# EAGLE schematic openservo-v28 (EAGLE 7.5.0)
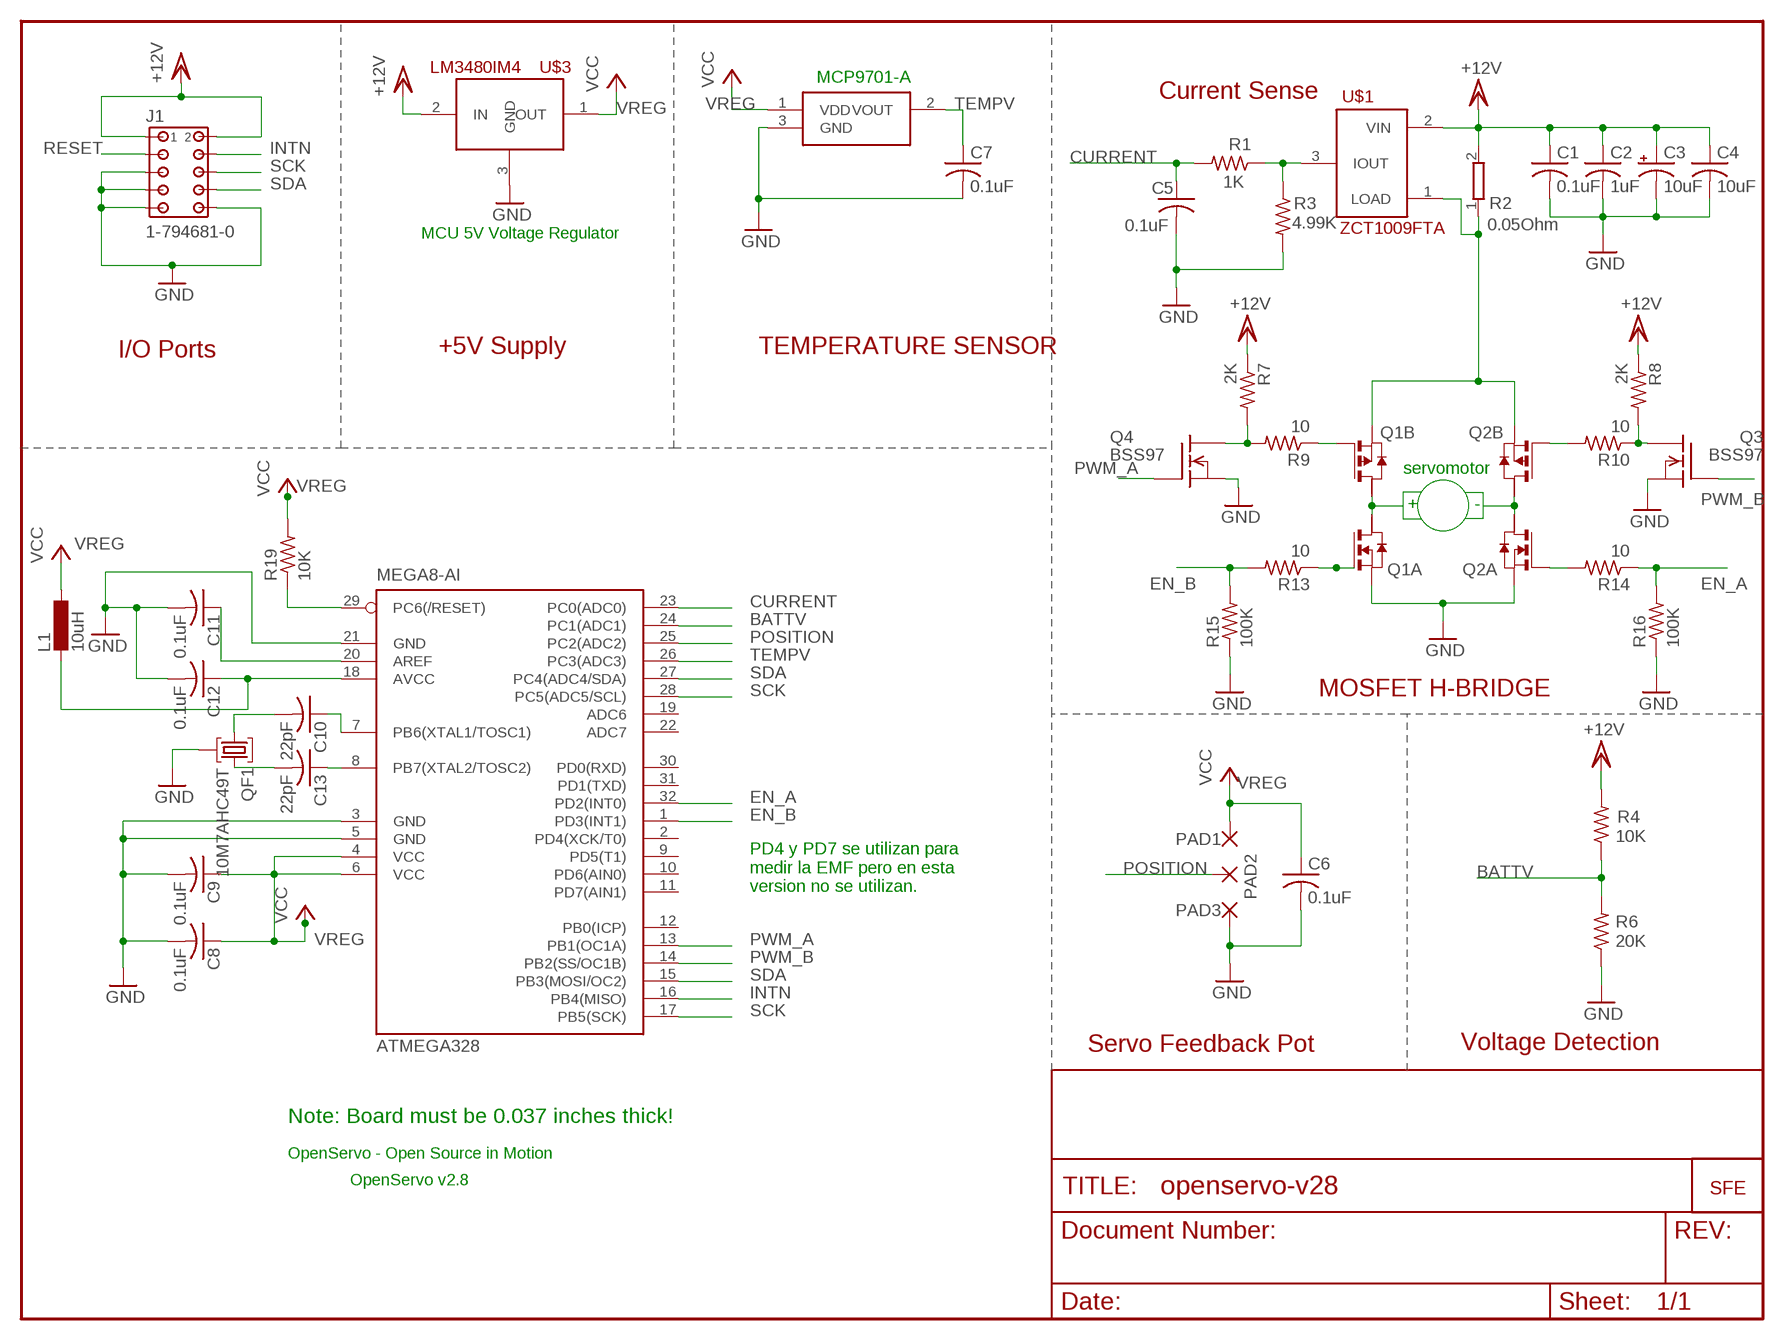
[diagram p0: schematic, sheet 1]

## Parts
ATMEGA328  MEGA8-AI  [TQFP32-08]
C1  0.1uF  C-USC0402  [C0402]
C2  1uF  C-USC0402  [C0402]
C3  10uF  CAP_POL3528  [EIA3528]
C4  10uF  C-USC0402  [C0402]
C5  0.1uF  C-USC0402  [C0402]
C6  0.1uF  C-USC0402  [C0402]
C7  0.1uF  C-USC0402  [C0402]
C8  0.1uF  C-USC0402  [C0402]
C9  0.1uF  C-USC0402  [C0402]
C10  22pF  C-USC0402  [C0402]
C11  0.1uF  C-USC0402  [C0402]
C12  0.1uF  C-USC0402  [C0402]
C13  22pF  C-USC0402  [C0402]
J1  1-794681-0  [1-794681-0]
L1  10uH  L-EU0204/5  [0204/5]
PAD1  1,6/0,9  [1,6/0,9]
PAD2  1,6/0,9  [1,6/0,9]
PAD3  1,6/0,9  [1,6/0,9]
Q1  PN_MOSFET-SO8  [SO8]
Q2  PN_MOSFET-SO8  [SO8]
Q3  BSS97  [TO202]
Q4  BSS97  [TO202]
QF1  10M7AHC49T  [HC49U]
R1  1K  R-US_R0402  [R0402]
R2  0.05Ohm  R1206W  [R1206W]
R3  4.99K  R-US_R0402  [R0402]
R4  10K  R-US_R0402  [R0402]
R6  20K  R-US_R0402  [R0402]
R7  2K  R-US_R0402  [R0402]
R8  2K  R-US_R0402  [R0402]
R9  10  R-US_R0402  [R0402]
R10  10  R-US_R0402  [R0402]
R13  10  R-US_R0402  [R0402]
R14  10  R-US_R0402  [R0402]
R15  100K  R-US_R0402  [R0402]
R16  100K  R-US_R0402  [R0402]
R19  10K  R-US_R0402  [R0402]
U$1  ZCT1009FTA  [SOT23-3]
U$2  MCP9701-A  [TO-92]
U$3  LM3480IM4  [SOT23-3]
U$7  LOGO-SFESK  [SFE-LOGO-FLAME]

## Nets
BATTV: ATMEGA328.24(PC1(ADC1)) R4.1 R6.2
CURRENT: ATMEGA328.23(PC0(ADC0)) C5.1 R1.2
EN_A: ATMEGA328.32(PD2(INT0)) R14.1 R16.2
EN_B: ATMEGA328.1(PD3(INT1)) R13.2 R15.2
GND: ATMEGA328.3(GND) ATMEGA328.5(GND) ATMEGA328.21(GND) C1.2 C2.2 C3.C(-) C4.2 C5.2 C6.2 C7.2 C8.2 C9.2 C11.2 C12.2 J1.5 J1.7 J1.9 J1.10 PAD3.1(P) Q1.1(A:S) Q2.1(A:S) Q3.1(S) Q4.1(S) QF1.2 R3.2 R6.1 R15.1 R16.1 U$2.3(GND) U$3.3(GND)
INTN: ATMEGA328.16(PB4(MISO)) J1.4
N$1: C10.2 QF1.1
N$2: Q4.2(D) R7.2 R9.2
N$3: Q1.4(B:G) R9.1
N$4: Q1.5(B:D) Q1.7(A:D)
N$5: Q2.4(B:G) R10.2
N$6: Q3.2(D) R8.2 R10.1
N$7: Q1.2(A:G) R13.1
N$8: Q2.2(A:G) R14.2
N$9: ATMEGA328.8(PB7(XTAL2/TOSC2)) C13.1
N$10: Q1.3(B:S) Q2.3(B:S) R2.1 U$1.1(LOAD)
N$11: ATMEGA328.7(PB6(XTAL1/TOSC1)) C10.1
N$12: R1.1 R3.1 U$1.3(IOUT)
N$13: Q2.5(B:D) Q2.7(A:D)
N$14: C13.2 QF1.3
N$23: ATMEGA328.18(AVCC) C12.1 L1.2
N$24: ATMEGA328.20(AREF) C11.1
POSITION: ATMEGA328.25(PC2(ADC2)) PAD2.1(P)
PWM_A: ATMEGA328.13(PB1(OC1A)) Q4.3(G)
PWM_B: ATMEGA328.14(PB2(SS/OC1B)) Q3.3(G)
RESET: ATMEGA328.29(PC6(/RESET)) J1.3 R19.1
SCK: ATMEGA328.17(PB5(SCK)) ATMEGA328.28(PC5(ADC5/SCL)) J1.6
SDA: ATMEGA328.15(PB3(MOSI/OC2)) ATMEGA328.27(PC4(ADC4/SDA)) J1.8
TEMPV: ATMEGA328.26(PC3(ADC3)) C7.1 U$2.2(VOUT)
VCC/2: C1.1 C2.1 C3.A(+) C4.1 J1.1 J1.2 R2.2 R4.2 R7.1 R8.1 U$1.2(VIN) U$3.2(IN) ; supply symbol labelled +12V
VREG: ATMEGA328.4(VCC) ATMEGA328.6(VCC) C6.1 C8.1 C9.1 L1.1 PAD1.1(P) R19.2 U$2.1(VDD) U$3.1(OUT) ; supply symbol labelled VCC
Unconnected: ATMEGA328.2(PD4(XCK/T0)) ATMEGA328.9(PD5(T1)) ATMEGA328.10(PD6(AIN0)) ATMEGA328.11(PD7(AIN1)) ATMEGA328.12(PB0(ICP)) ATMEGA328.19(ADC6) ATMEGA328.22(ADC7) ATMEGA328.30(PD0(RXD)) ATMEGA328.31(PD1(TXD)) Q1.6(B:D2) Q1.8(A:D2) Q2.6(B:D2) Q2.8(A:D2)

## Notes on the sheet
- MCP9701-A
- Current Sense
- MCU 5V Voltage Regulator
- I/O Ports | +5V Supply | TEMPERATURE SENSOR
- servomotor
- + | -
- MOSFET H-BRIDGE
- PD4 y PD7 se utilizan para
  medir la EMF pero en esta
  version no se utilizan.
- Servo Feedback Pot | Voltage Detection
- Note: Board must be 0.037 inches thick!
- OpenServo - Open Source in Motion
- OpenServo v2.8

## Library data of the parts
ATMEGA328 = atmel:MEGA8: MICROCONTROLLER 8 Kbytes FLASH, 1 kbytes SRAM, 512 bytes EEPROM, USART, 6-channel 10 bit ADC, 2-channel 8 bit ADC Pin compatible with Atmega48, ATMega88, ATMega168 Source: avr.lbr; MPN: ATMEGA8-16AU; OC_FARNELL: 9171371; OC_NEWARK: 73M8863
C1 C2 C4-C13 = rcl:C-US: CAPACITOR, American symbol
C3 = SparkFun:CAP_POL: Capacitor Polarized These are standard SMD and PTH capacitors. Normally 10uF, 47uF, and 100uF in electrolytic and tantalum varieties. Always verify the external diameter of the through hole cap, it varies with capacity, voltage, and manufacturer. The EIA devices should be standard.
J1 = con-amp:1-794681-0: Micro MATE-N-LOK Connectors grid 1.5mm Dual Row Through Hole Vertical Metal Through Hole Holddowns Source: ENG_CD_794681_E.pdf
L1 = rcl:L-EU: INDUCTOR, European symbol
PAD1-PAD3 = wirepad:1,6/0,9: THROUGH-HOLE PAD
Q1 Q2 = zetex:PN_MOSFET-: DUAL N AND P-CHANNEL ENHANCEMENT MODE MOSFET source ZXMD63C02.pdf from http://www.zetex.com/
Q3 Q4 = transistor-fet:BSS97: N-Channel Enhancement MOSFET 200V; 1.5A; 1,6Ohm
QF1 = crystal:10M*A: Monolithic Crystal Filters Source: www.vanlong.com; OC_FARNELL: unknown; OC_NEWARK: unknown
R1 R3 R4 R6-R10 R13-R16 R19 = rcl:R-US_: RESISTOR, American symbol
R2 = openservo:R1206W
U$1 = SparkFun:ZCT1009FTA
U$2 = mcp9701-a:MCP9701-A
U$3 = SparkFun:LM3480IM4
U$7 = SparkFun:LOGO-SFE: Spark Fun Electronics PCB Logo This is the standard Spark Fun Electronics PCB logo.